# EAGLE design HW2schem (EAGLE 8.1.0)
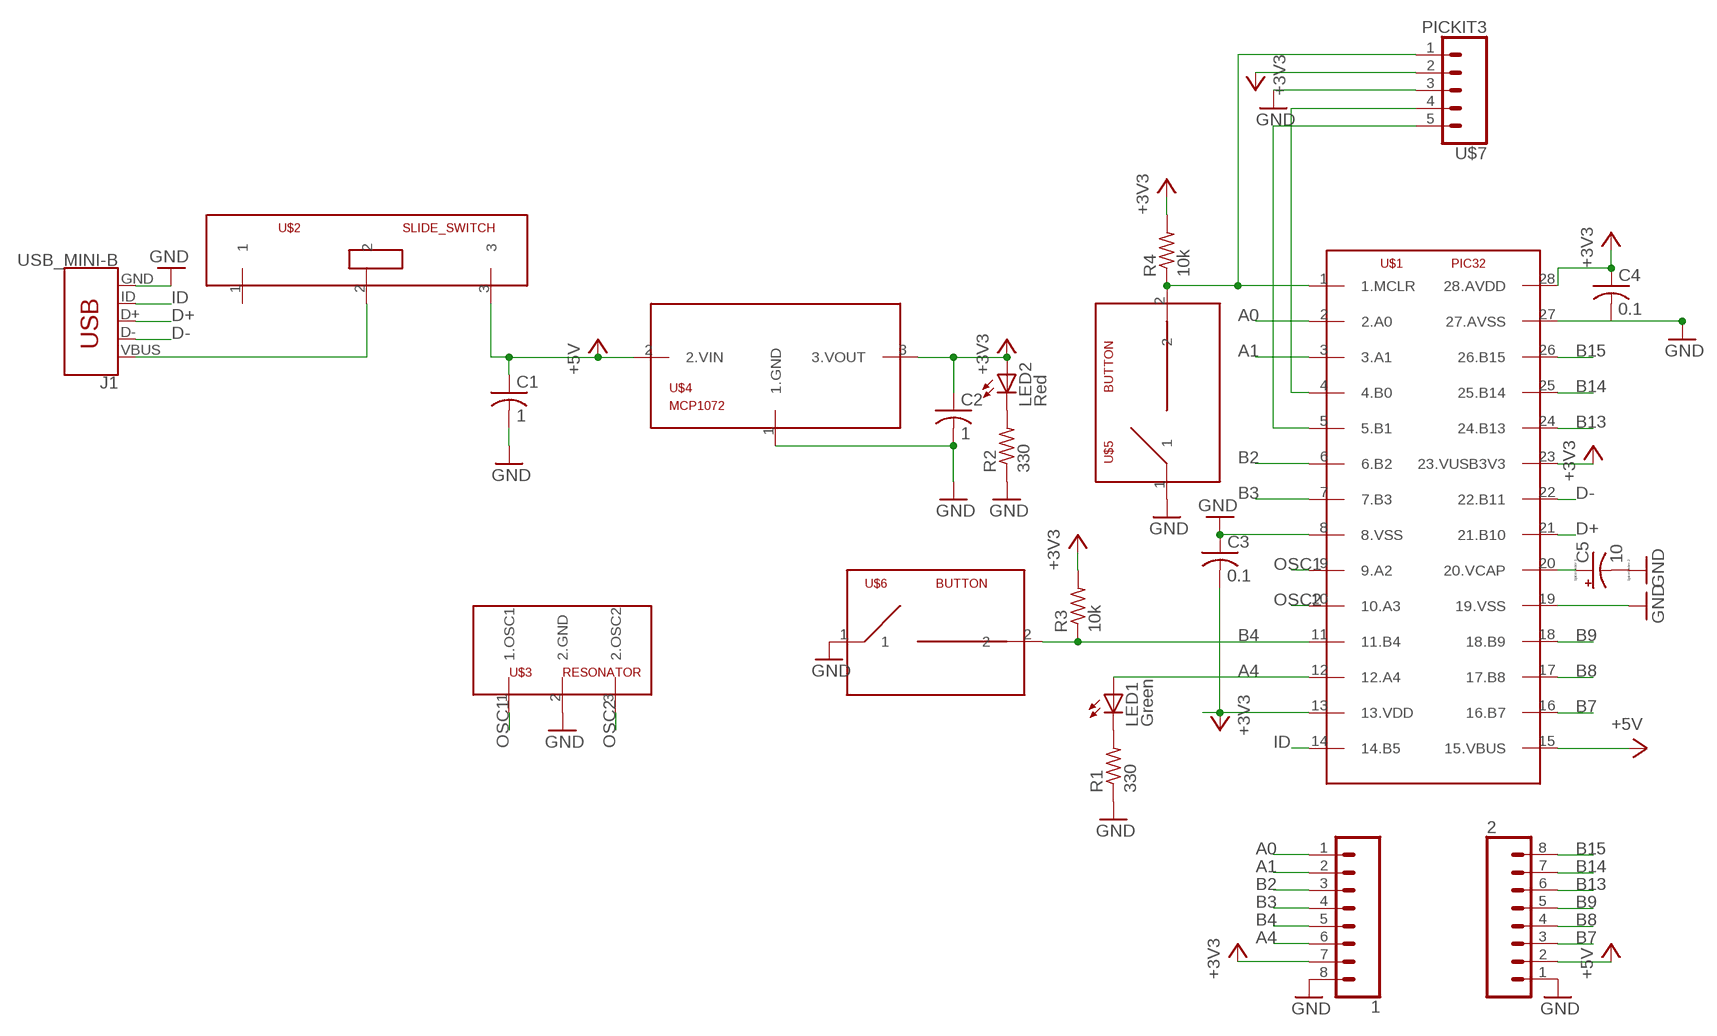
[diagram p0: schematic, sheet 1]

## Parts
1  CONN_08NO_SILK_FEMALE_PTH  [1X08_NO_SILK]
2  CONN_08NO_SILK_FEMALE_PTH  [1X08_NO_SILK]
C1  1  C-US025-024X044  [C025-024X044]
C2  1  C-US025-024X044  [C025-024X044]
C3  0.1  C-US025-024X044  [C025-024X044]
C4  0.1  C-US025-024X044  [C025-024X044]
C5  10  CPOL-USB45181A  [B45181A]
J1  USB_MINI-B  [USB-MB-H]
LED1  Green  LED3MM  [LED3MM]
LED2  Red  LED3MM  [LED3MM]
R1  330  R-US_0204/7  [0204/7]
R2  330  R-US_0204/7  [0204/7]
R3  10k  R-US_0204/7  [0204/7]
R4  10k  R-US_0204/7  [0204/7]
U$1  PIC32  [DIL28-3]
U$2  SLIDE_SWITCH  [SLIDE_SWITCH]
U$3  RESONATOR  [RESONATOR]
U$4  MCP1072  [TO92]
U$5  BUTTON  [BUTTON]
U$6  BUTTON  [BUTTON]
U$7  PICKIT3  [PICKIT3]

## Nets
+3V3: 1.7 C2.1 C3.2 C4.1 LED2.A R3.2 R4.2 U$1.13(13.VDD) U$1.23(23.VUSB3V3) U$1.28(28.AVDD) U$4.3(3.VOUT) U$7.2(4.B0)
+5V: 2.2 C1.1 U$1.15(15.VBUS) U$2.3 U$4.2(2.VIN)
A0: 1.1 U$1.2(2.A0)
A1: 1.2 U$1.3(3.A1)
A4: 1.6 LED1.A U$1.12(12.A4)
B2: 1.3 U$1.6(6.B2)
B3: 1.4 U$1.7(7.B3)
B4: 1.5 R3.1 U$1.11(11.B4) U$6.2
B7: 2.3 U$1.16(16.B7)
B8: 2.4 U$1.17(17.B8)
B9: 2.5 U$1.18(18.B9)
B13: 2.6 U$1.24(24.B13)
B14: 2.7 U$1.25(25.B14)
B15: 2.8 U$1.26(26.B15)
D+: J1.D+ U$1.21(21.B10)
D-: J1.D- U$1.22(22.B11)
GND: 1.8 2.1 C1.2 C2.2 C3.1 C4.2 C5.- J1.GND R1.1 R2.1 U$1.8(8.VSS) U$1.19(19.VSS) U$1.27(27.AVSS) U$3.2(2.GND) U$4.1(1.GND) U$5.1 U$6.1 U$7.3(3.GND)
ID: J1.ID U$1.14(14.B5)
N$1: LED2.K(C) R2.2
N$2: R4.1 U$1.1(1.MCLR) U$5.2 U$7.1(5.B1)
N$3: C5.+ U$1.20(20.VCAP)
N$4: LED1.K(C) R1.2
N$7: J1.VBUS U$2.2
N$10: U$1.4(4.B0) U$7.4(2.VDD)
N$11: U$1.5(5.B1) U$7.5(1.MCLR)
OSC1: U$1.9(9.A2) U$3.1(1.OSC1)
OSC2: U$1.10(10.A3) U$3.3(2.OSC2)
Unconnected: U$2.1

## Library data of the parts
1 2 = HW2Lib:CONN_08: Multi connection point. Often used as Generic Header-pin footprint for 0.1 inch spaced/style header connections On any of the 0.1 inch spaced packages, you can populate with these: Break Away Headers - Straight <https://www.sparkfun.com/products/116> (PRT-00116) Break Away Male Headers - Right Angle <https://www.sparkfun.com/products/553> (PRT-00553) Female Headers <https://www.sparkfun.com/products/115> (PRT-00115) Break Away Headers - Machine Pin <https://www.sparkfun.com/products/117> (PRT-00117) Break Away Female Headers - Swiss Machine Pin <https://www.sparkfun.com/products/743> (PRT-00743) Arduino Stackable Header - 8 Pin <https://www.sparkfun.com/products/9279> (PRT-09279) For SCREWTERMINALS and SPRING TERMINALS visit here: Screw Terimnals on SparkFun.com <https://www.sparkfun.com/search/results?term=Screw+Terminals> (5mm/3.5mm/2.54mm spacing) This device is also useful as a general connection point to wire up your design to another part of your project. Our various solder wires solder well into these plated through hole pads. Hook-Up Wire - Assortment (Stranded, 22 AWG) <https://www.sparkfun.com/products/11375> (PRT-11375) Hook-Up Wire - Assortment (Solid Core, 22 AWG) <https://www.sparkfun.com/products/11367> (PRT-11367) View the entire wire category on our website here <https://www.sparkfun.com/categories/141> Special notes: Molex polarized connector foot print use with SKU : PRT-08231 with associated crimp pins and housings. 1MM SMD Version SKU: PRT-10208 NOTES ON THE VARIANTS LOCK and LOCK_LONGPADS... This footprint was designed to help hold the alignment of a through-hole component (i.e. 6-pin header) while soldering it into place. You may notice that each hole has been shifted either up or down by 0.005 of an inch from it's more standard position (which is a perfectly straight line). This slight alteration caused the pins (the squares in the middle) to touch the edges of the holes. Because they are alternating, it causes a "brace" to hold the component in place. 0.005 has proven to be the perfect amount of "off-center" position when using our standard breakaway headers. Although looks a little odd when you look at the bare footprint, once you have a header in there, the alteration is very hard to notice. Also,if you push a header all the way into place, it is covered up entirely on the bottom side.; PROD_ID: CONN-08438
C1-C4 = HW2Lib:C-US: CAPACITOR, American symbol
C5 = HW2Lib:CPOL-US: POLARIZED CAPACITOR, American symbol
J1 = HW2Lib:USB_MINI-B: USB type Mini-B Connector Breaks out 5th pin, and includes shield pins if needed. SparkFun Products: SparkFun FTDI Basic Breakout <https://www.sparkfun.com/products/9716> SparkFun XBee Explorer USB <https://www.sparkfun.com/products/11812> SparkFun Redboard <https://www.sparkfun.com/products/12757>
LED1 LED2 = HW2Lib:LED: LED OSRAM: - CHIPLED LG R971, LG N971, LY N971, LG Q971, LY Q971, LO R971, LY R971 LH N974, LH R974 LS Q976, LO Q976, LY Q976 LO Q996 - Hyper CHIPLED LW Q18S LB Q993, LB Q99A, LB R99A - SideLED LS A670, LO A670, LY A670, LG A670, LP A670 LB A673, LV A673, LT A673, LW A673 LH A674 LY A675 LS A676, LA A676, LO A676, LY A676, LW A676 LS A679, LY A679, LG A679 - Hyper Micro SIDELED® LS Y876, LA Y876, LO Y876, LY Y876 LT Y87S - SmartLED LW L88C, LW L88S LB L89C, LB L89S, LG L890 LS L89K, LO L89K, LY L89K LS L896, LA L896, LO L896, LY L896 - TOPLED LS T670, LO T670, LY T670, LG T670, LP T670 LSG T670, LSP T670, LSY T670, LOP T670, LYG T670 LG T671, LOG T671, LSG T671 LB T673, LV T673, LT T673, LW T673 LH T674 LS T676, LA T676, LO T676, LY T676, LB T676, LH T676, LSB T676, LW T676 LB T67C, LV T67C, LT T67C, LS T67K, LO T67K, LY T67K, LW E67C LS E67B, LA E67B, LO E67B, LY E67B, LB E67C, LV E67C, LT E67C LW T67C LS T679, LY T679, LG T679 LS T770, LO T770, LY T770, LG T770, LP T770 LB T773, LV T773, LT T773, LW T773 LH T774 LS E675, LA E675, LY E675, LS T675 LS T776, LA T776, LO T776, LY T776, LB T776 LHGB T686 LT T68C, LB T68C - Hyper Mini TOPLED® LB M676 - Mini TOPLED Santana® LG M470 LS M47K, LO M47K, LY M47K Source: http://www.osram.convergy.de LUXEON: - LUMILED® LXK2-PW12-R00, LXK2-PW12-S00, LXK2-PW14-U00, LXK2-PW14-V00 LXK2-PM12-R00, LXK2-PM12-S00, LXK2-PM14-U00 LXK2-PE12-Q00, LXK2-PE12-R00, LXK2-PE12-S00, LXK2-PE14-T00, LXK2-PE14-U00 LXK2-PB12-K00, LXK2-PB12-L00, LXK2-PB12-M00, LXK2-PB14-N00, LXK2-PB14-P00, LXK2-PB14-Q00 LXK2-PR12-L00, LXK2-PR12-M00, LXK2-PR14-Q00, LXK2-PR14-R00 LXK2-PD12-Q00, LXK2-PD12-R00, LXK2-PD12-S00 LXK2-PH12-R00, LXK2-PH12-S00 LXK2-PL12-P00, LXK2-PL12-Q00, LXK2-PL12-R00 Source: www.luxeon.com KINGBRIGHT: KA-3528ASYC Source: www.kingbright.com
R1-R4 = HW2Lib:R-US_: RESISTOR, American symbol
U$1 = HW2Lib:PIC32
U$2 = HW2Lib:SLIDE_SWITCH
U$3 = HW2Lib:RESONATOR
U$4 = HW2Lib:MCP1072
U$5 U$6 = HW2Lib:BUTTON
U$7 = HW2Lib:PICKIT3

## Board
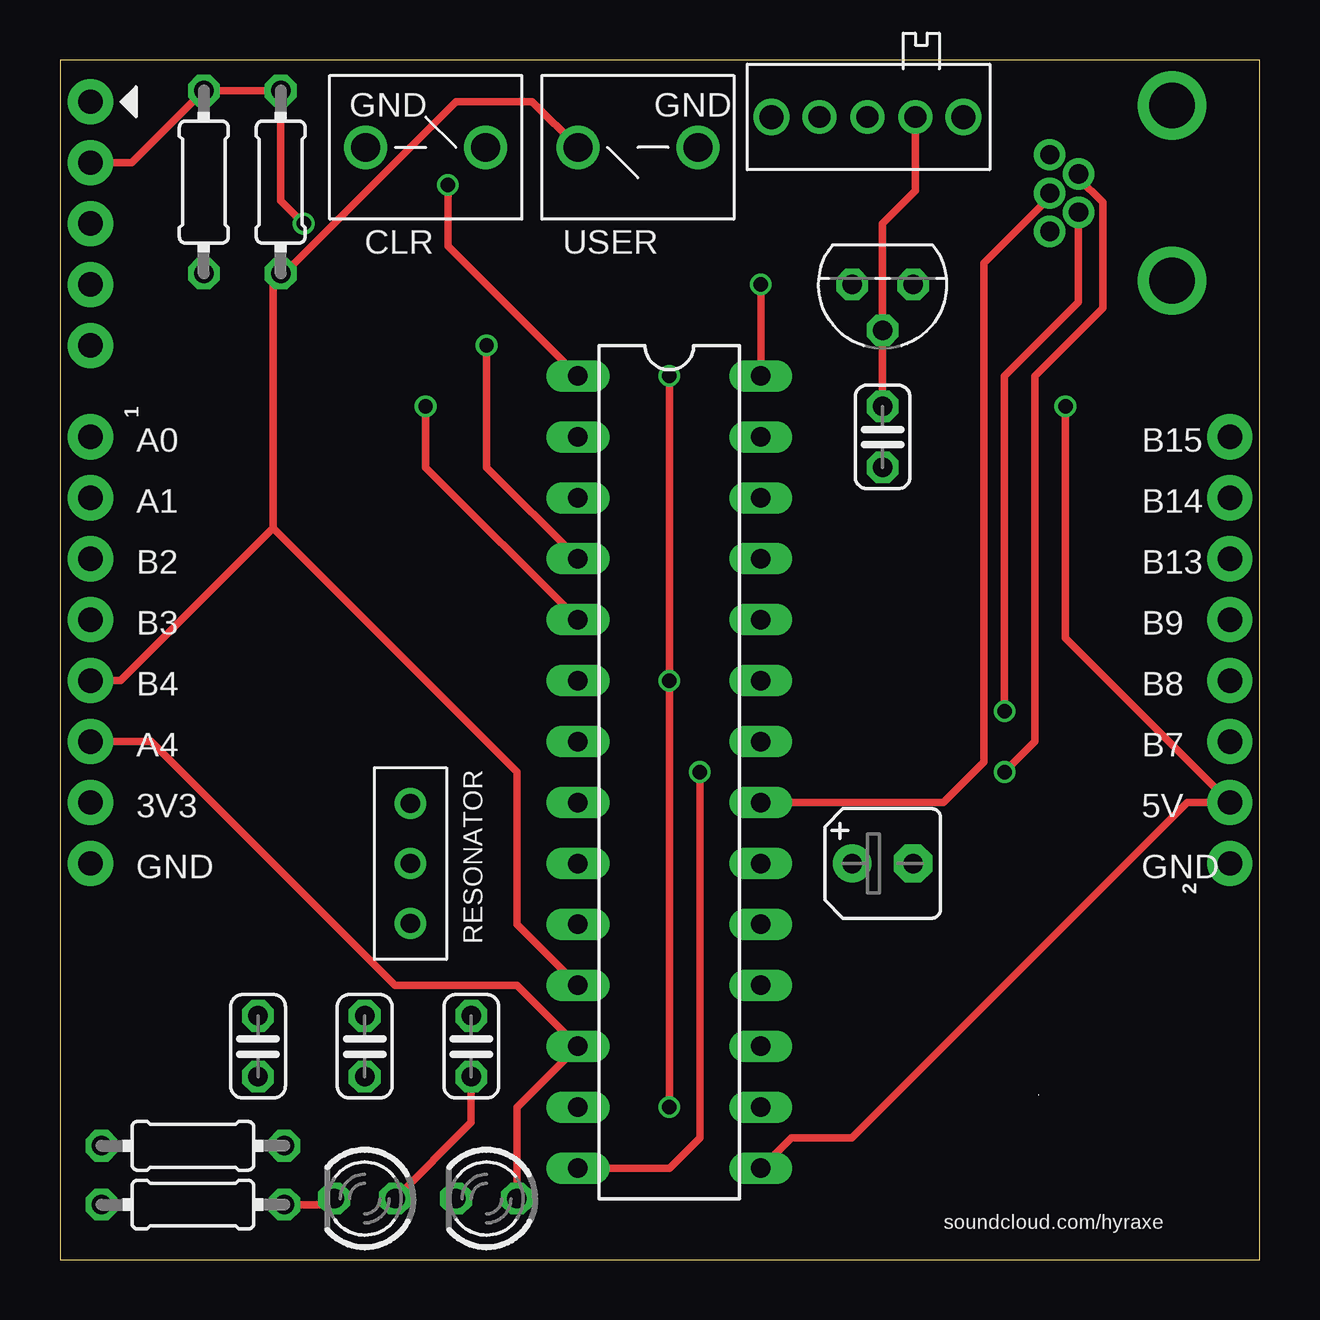
[diagram p1: board, top side]
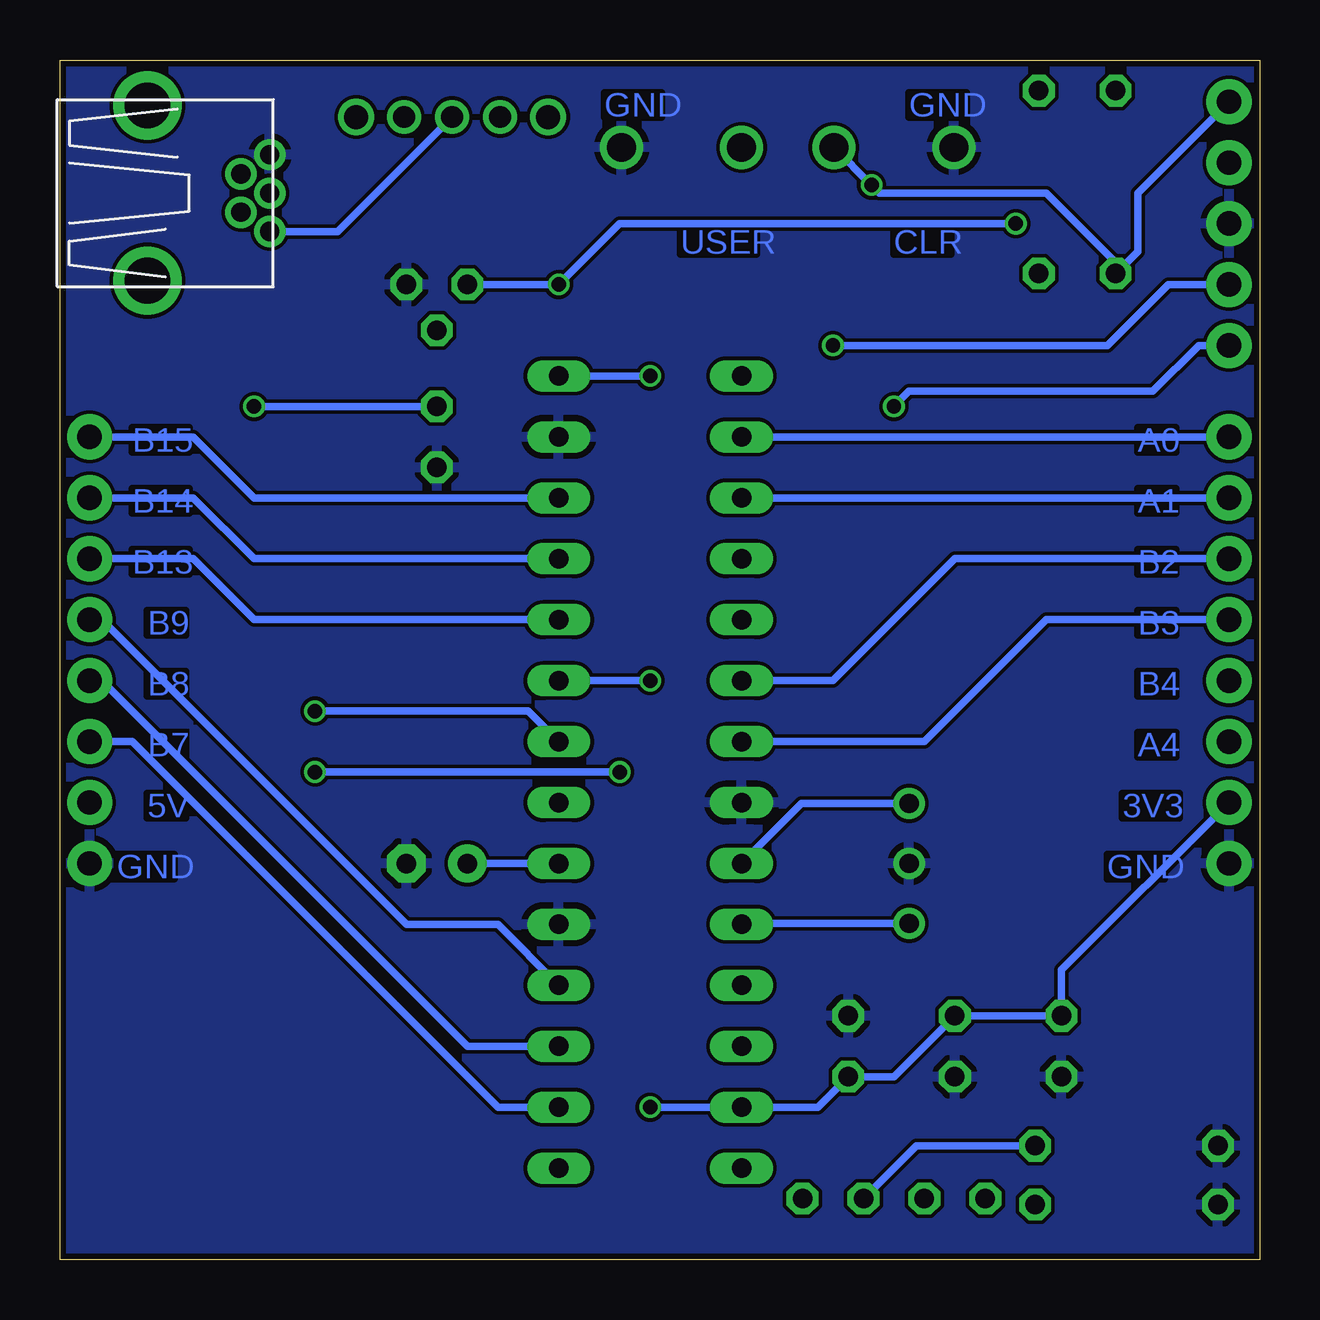
[diagram p2: board, bottom side, seen from below]

Size 50 x 50 mm. Coordinates in mm from the lower left corner, seen from the top.
Outline: 0,0 50,0 50,50 0,50 0,0
Copper layers (1*16): Top 0.035mm / dielectric 1.5mm / Bottom 0.035mm
Design rules "SeeedStudio_2layer_DRU_no_angle_20140221": minimum track width 6mil, minimum drill 12mil, track to track 6mil, track to pad 6mil, pad to pad 6mil, via to via 6mil, smd to smd 0mil, copper to edge 10mil, drill to drill 10mil, minimum pad ring 10mil, minimum via ring 6mil, stop-mask expansion 2mil, vias tented up to drill 100mil, thermal gap 10mil

### Footprints (pad centres in the part's own frame; a part is rotated, then mirrored left to right if it is on the bottom)
1X08_NO_SILK = drill 1.016 pad 1.88: 1 0,0; 2 2.54,0; 3 5.08,0; 4 7.62,0; 5 10.16,0; 6 12.7,0; 7 15.24,0; 8 17.78,0
C025-024X044 = drill 0.813 octagon: 1 -1.27,0; 2 1.27,0
B45181A = drill 0.813 pad 1.6: + -1.27,0 | drill 0.813 pad 1.6 octagon: - 1.27,0
USB-MB-H = drill 0.8: D+ 5.1,0; D- 3.9,0.8; GND 5.1,-1.6; ID 3.9,-0.8; VBUS 5.1,1.6 | drill 1.9: P$6 0,-3.65; P$7 0,3.65
LED3MM = drill 0.813 octagon: A -1.27,0; K 1.27,0
0204/7 = drill 0.813 octagon: 1 -3.81,0; 2 3.81,0
DIL28-3 = drill 0.813 long: 1 -16.51,-3.81; 2 -13.97,-3.81; 3 -11.43,-3.81; 4 -8.89,-3.81; 5 -6.35,-3.81; 6 -3.81,-3.81; 7 -1.27,-3.81; 8 1.27,-3.81; 9 3.81,-3.81; 10 6.35,-3.81; 11 8.89,-3.81; 12 11.43,-3.81; 13 13.97,-3.81; 14 16.51,-3.81; 15 16.51,3.81; 16 13.97,3.81; 17 11.43,3.81; 18 8.89,3.81; 19 6.35,3.81; 20 3.81,3.81; 21 1.27,3.81; 22 -1.27,3.81; 23 -3.81,3.81; 24 -6.35,3.81; 25 -8.89,3.81; 26 -11.43,3.81; 27 -13.97,3.81; 28 -16.51,3.81
SLIDE_SWITCH = drill 0.9: 1 -2,0; 2 0,0; 3 2,0 | drill 1: P$1 -4,0; P$2 4,0
RESONATOR = drill 0.8: 1 2.5,0; 2 0,0; 3 -2.5,0
TO92 = drill 0.813 octagon: 1 -1.27,0; 2 0,1.905; 3 1.27,0
BUTTON = drill 1.2: 1 -2.5,0; 2 2.5,0
PICKIT3 = drill 1.016 pad 1.88: 1 0,0; 2 2.54,0; 3 5.08,0; 4 7.62,0; 5 10.16,0

### Placement (x,y rotation side)
1  1.27,34.29 270 top
2  48.77,16.51 90 top
C1  34.29,34.29 270 top
C2  12.7,8.89 270 top
C3  17.14,8.89 270 top
C4  8.26,8.89 270 top
C5  34.29,16.51 0 top
J1  46.35,44.45 180 top
LED1  17.78,2.54 180 top
LED2  12.7,2.54 180 top
R1  5.54,4.74 0 top
R2  5.54,2.29 0 top
R3  9.2,44.91 90 top
R4  6,44.91 90 top
U$1  25.4,20.32 270 top
U$2  33.66,47.62 0 top
U$3  14.61,16.51 90 top
U$4  34.29,40.64 180 top
U$5  15.24,46.35 0 top
U$6  24.09,46.35 180 top
U$7  1.27,48.26 270 top

### Tracks (layer width: path | path; a pad name or v marks a point on that pad's centre or on a via)
+3V3  (via drill 0.6)
  Top 0.305: U$7.2 3,45.72 R4.2 R3.2 9.2,44.14 v10.16,43.18 | v29.21,40.64 U$1.28 | v25.4,36.83 v25.4,24.13 v25.4,6.35 | C3.2 17.14,5.71 LED2.A
  Bottom 0.305: v10.16,43.18 26.67,43.18 v29.21,40.64 U$4.3 | U$1.28 v25.4,36.83 | v25.4,24.13 U$1.23 | v25.4,6.35 U$1.13 18.41,6.35 C3.2 15.24,7.62 C2.1 C4.1 8.26,12.06 1.7
+5V  (via drill 0.6)
  Top 0.305: U$2.3 35.66,44.55 34.29,43.18 U$4.2 C1.1 | v41.91,35.56 41.91,25.91 2.2 46.99,19.05 33.02,5.08 30.48,5.08 U$1.15
  Bottom 0.305: C1.1 v41.91,35.56
A0
  Bottom 0.305: 1.1 U$1.2
A1
  Bottom 0.305: 1.2 U$1.3
A4
  Top 0.305: LED1.A 19.05,6.35 U$1.12 19.05,11.43 13.97,11.43 3.81,21.59 1.6
B2
  Bottom 0.305: 1.3 12.7,29.21 17.78,24.13 U$1.6
B3
  Bottom 0.305: 1.4 8.89,26.67 13.97,21.59 U$1.7
B4
  Top 0.305: U$6.2 19.68,48.26 16.51,48.26 9.35,41.1 R3.1 8.89,40.79 8.89,30.48 | 1.5 2.54,24.13 8.89,30.48 | 8.89,30.48 19.05,20.32 19.05,13.97 U$1.11
B7
  Bottom 0.305: 2.3 46.99,21.59 31.75,6.35 U$1.16
B8
  Bottom 0.305: 2.4 48.26,24.13 33.02,8.89 U$1.17
B9
  Bottom 0.305: 2.5 48.26,26.67 35.56,13.97 31.75,13.97 U$1.18
B13
  Bottom 0.305: 2.6 44.45,29.21 41.91,26.67 U$1.24
B14
  Bottom 0.305: 2.7 44.45,31.75 41.91,29.21 U$1.25
B15
  Bottom 0.305: 2.8 44.45,34.29 41.91,31.75 U$1.26
D+
  Top 0.305: J1.D+ 41.26,44.28 38.51,41.53 38.51,20.73 36.83,19.05 U$1.21
D-  (via drill 0.6)
  Top 0.305: J1.D- 42.45,39.91 39.37,36.83 v39.37,22.86
  Bottom 0.305: v39.37,22.86 30.48,22.86 U$1.22
GND
  pour Bottom (isolate 0.012): 0,0 0,50 50,50 50,0
ID  (via drill 0.6)
  Top 0.305: J1.ID 42.45,45.08 43.47,44.07 43.47,39.66 40.64,36.83 40.64,21.59 v39.37,20.32 | v26.67,20.32 26.67,5.08 25.4,3.81 U$1.14
  Bottom 0.305: v39.37,20.32 v26.67,20.32
N$1
  Top 0.305: R2.2 11.18,2.29 LED2.K
N$2  (via drill 0.6)
  Top 0.305: v16.17,44.79 16.17,42.25 U$1.1
  Bottom 0.305: U$7.1 5.08,44.45 5.08,42.02 R4.1 6,41.55 8.89,44.45 15.84,44.45 v16.17,44.79 U$5.2
N$3
  Bottom 0.305: C5.+ U$1.20
N$4
  Bottom 0.305: R1.2 14.31,4.74 LED1.K
N$7
  Bottom 0.305: J1.VBUS 38.43,42.85 U$2.2
N$10  (via drill 0.6)
  Top 0.305: v17.78,38.1 17.78,33.02 U$1.4
  Bottom 0.305: U$7.4 3.81,40.64 6.35,38.1 v17.78,38.1
N$11  (via drill 0.6)
  Top 0.305: v15.24,35.56 15.24,33.02 U$1.5
  Bottom 0.305: U$7.5 2.54,38.1 4.45,36.2 14.61,36.2 v15.24,35.56
OSC1
  Bottom 0.305: U$3.1 19.09,19.01 U$1.9
OSC2
  Bottom 0.305: U$3.3 21.55,14.01 U$1.10

### Text on the board
Bottom: GND | GND | CLR | USER | A0 | B15 | A1 | B14 | B2 | B13 | B3 | B9 | B4 | B8 | A4 | B7 | 3V3 | 5V | GND | GND
tPlace: GND | GND | CLR | USER | A0 | B15 | A1 | B14 | B2 | B13 | B3 | B9 | B4 | B8 | A4 | B7 | 3V3 | 5V | GND | GND | soundcloud.com/hyraxe